# EAGLE schematic Example (EAGLE 7.6.0)
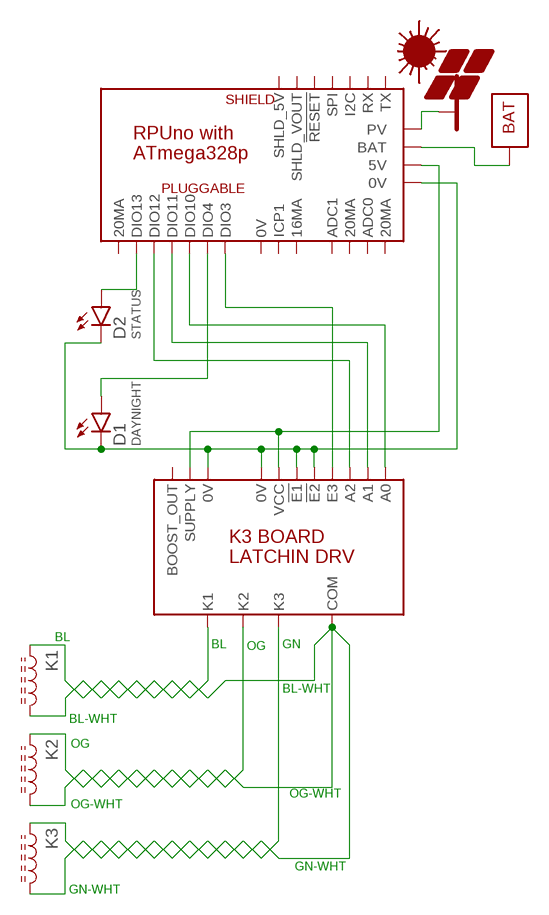
[diagram p0: schematic, sheet 1]

## Parts
BM3  RPUNO  [NA-30]
D1  DAYNIGHT  LED5MM  [LED5MM]
D2  STATUS  LED5MM  [LED5MM]
K1  L0805  [C0805(2012)]
K2  L0805  [C0805(2012)]
K3  L0805  [C0805(2012)]
PV4  PV  [NA-30]
U$1  K3  [NA-30]
U$7  BAT  [NA-30]

## Nets
BL: K1.1 U$1.11(K1)
BL-WHT: K1.2 U$1.9(COM)
GN: K3.1 U$1.13(K3)
GN-WHT: K3.2
N$1: BM3.19(5V) U$1.14(SUPPLY) U$1.15(VCC)
N$2: BM3.13(DIO3) U$1.10(E3)
N$3: BM3.20(0V) D1.K D2.K U$1.1(!E1) U$1.2(!E2) U$1.3(0V) U$1.4(0V)
N$4: BM3.15(DIO10) U$1.5(A0)
N$5: BM3.16(DIO11) U$1.6(A1)
N$6: BM3.17(DIO12) U$1.7(A2)
N$7: BM3.18(DIO13) D2.A
N$8: BM3.14(DIO4) D1.A
N$31: BM3.9(BAT) U$7.1(BAT_PWR)
N$34: BM3.8(PV) PV4.1(PV_PWR)
OG: K2.1 U$1.12(K2)
OG-WHT: K2.2
Unconnected: BM3.1(TX) BM3.2(RX) BM3.3(I2C) BM3.4(SPI) BM3.5(!RESET) BM3.6(SHLD_5V) BM3.7(SHLD_VOUT) BM3.10(ADC0) BM3.11(ADC1) BM3.12(ICP1) BM3.21(16MA) BM3.22(20MA) BM3.23(20MA) BM3.24(20MA) BM3.25(0V) U$1.8(BOOST_OUT)

## Library data of the parts
BM3 = Documentation:RPUNO: BM /w 328p
D1 D2 = D-LED:LED: LED 120120WH [CREE,XHGAWT-00-0000-00000HXE1] LED WHITE 6500K 150LUM-W120120
K1-K3 = L-PWR:L: Inductor
PV4 = Documentation:PV
U$1 = Documentation:K3: Latching Solenoids
U$7 = Documentation:BAT